# EAGLE schematic schematic (EAGLE 9.6.2)
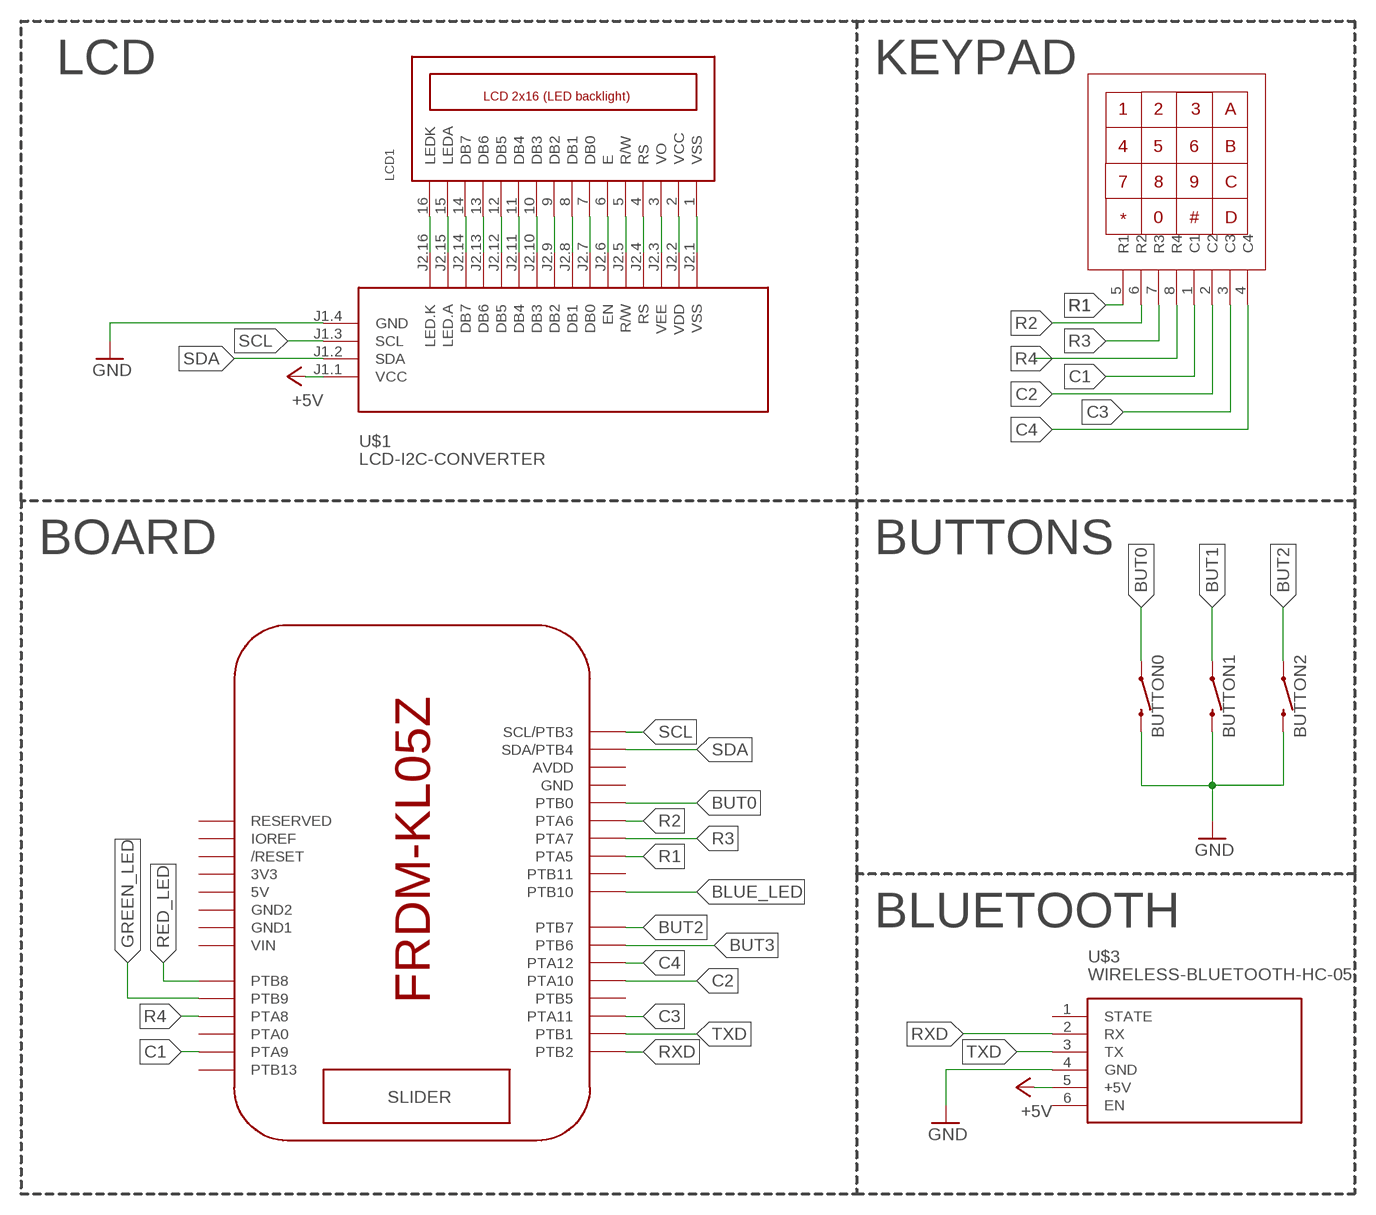
[diagram p0: schematic, sheet 1]

## Parts
BUTTON0  MOMENTARY-SWITCH-SPST-PTH-6.0MM  [TACTILE_SWITCH_PTH_6.0MM]
BUTTON1  MOMENTARY-SWITCH-SPST-PTH-6.0MM  [TACTILE_SWITCH_PTH_6.0MM]
BUTTON2  MOMENTARY-SWITCH-SPST-PTH-6.0MM  [TACTILE_SWITCH_PTH_6.0MM]
LCD1  LCD_2X16_SIL  [HY-1602F]
U1  ARDUINOR3-BPLACE  [ARDUINOR3-BPLACE]
U$1  LCD-I2C-CONVERTER  [LCD-I2C-CONVERTER]
U$2  KEYPAD4X4  [KEYPAD4X4]
U$3  WIRELESS-BLUETOOTH-HC-05  [WIRELESS-BLUETOOTH-HC-05]

## Nets
+5V: U$1.J1.1(VCC) U$3.5(+5V)
BLUE_LED: U1.GND2(PTB10)
BUT0: BUTTON0.1 U1.D8(PTB0)
BUT1: BUTTON1.1
BUT2: BUTTON2.1 U1.D13(PTB7)
BUT3: U1.D12(PTB6)
C1: U1.D4(PTA9) U$2.1(C1)
C2: U1.D5(PTA10) U$2.2(C2)
C3: U1.D6(PTA11) U$2.3(C3)
C4: U1.D7(PTA12) U$2.4(C4)
GND: BUTTON0.3 BUTTON1.3 BUTTON2.3 U$1.J1.4(GND)
GREEN_LED: U1.GND1(PTB9)
N$1: LCD1.16(LEDK) U$1.J2.16(LED.K)
N$2: LCD1.15(LEDA) U$1.J2.15(LED.A)
N$3: LCD1.14(DB7) U$1.J2.14(DB7)
N$4: LCD1.13(DB6) U$1.J2.13(DB6)
N$5: LCD1.12(DB5) U$1.J2.12(DB5)
N$6: LCD1.11(DB4) U$1.J2.11(DB4)
N$7: LCD1.10(DB3) U$1.J2.10(DB3)
N$8: LCD1.9(DB2) U$1.J2.9(DB2)
N$9: LCD1.8(DB1) U$1.J2.8(DB1)
N$10: LCD1.7(DB0) U$1.J2.7(DB0)
N$11: LCD1.5(R/W) U$1.J2.5(R/W)
N$12: LCD1.6(E) U$1.J2.6(EN)
N$13: LCD1.4(RS) U$1.J2.4(RS)
N$14: LCD1.3(VO) U$1.J2.3(VEE)
N$15: LCD1.2(VCC) U$1.J2.2(VDD)
N$16: LCD1.1(VSS) U$1.J2.1(VSS)
N$17: U$3.4(GND) ; supply symbol labelled GND
R1: U1.D0(PTA5) U$2.5(R1)
R2: U1.D1(PTA6) U$2.6(R2)
R3: U1.D2(PTA7) U$2.7(R3)
R4: U1.D3(PTA8) U$2.8(R4)
RED_LED: U1.GND(PTB8)
RXD: U1.D10(PTB2) U$3.2(RX)
SCL: U1.SCL(SCL/PTB3) U$1.J1.3(SCL)
SDA: U1.SDA(SDA/PTB4) U$1.J1.2(SDA)
TXD: U1.D9(PTB1) U$3.3(TX)
Unconnected: U1.3V(/RESET) U1.A1(AVDD) U1.A5(IOREF) U1.AREF(PTA0) U1.D11(PTB5) U1.IOREF(PTB11) U1.RESERVED(PTB13) U1.RESET(RESERVED) U$3.1(STATE) U$3.6(EN)

## Notes on the sheet
- LCD | KEYPAD
- BOARD | BUTTONS
- BLUETOOTH

## Power pins joined to a net without a drawn wire
3V3: U1.5V(3V3)
5V: U1.A0(5V)
GND: U1.A2(GND)
GND1: U1.A3(GND1)
GND2: U1.A4(GND2)
VIN: U1.VIN

## Library data of the parts
BUTTON0 BUTTON1 BUTTON2 = SparkFun-Switches:MOMENTARY-SWITCH-SPST: Momentary Switch (Pushbutton) - SPST Normally-open (NO) SPST momentary switches (buttons, pushbuttons). Variants PTH-12MM - 12mm square, through-hole Momentary Pushbutton Switch - 12mm Square <https://www.sparkfun.com/products/9190> (COM-09190) PTH-6.0MM, PTH-6.0MM-KIT - 6.0mm square, through-hole Mini Pushbutton Switch <https://www.sparkfun.com/products/97> (COM-00097) KIT package intended for soldering kit's - only one side of pads' copper is exposed. PTH-RIGHT-ANGLE-KIT - Right-angle, through-hole Right Angle Tactile Button <https://www.sparkfun.com/products/10791> - Used on SparkFun BigTime Watch Kit <https://www.sparkfun.com/products/11734> SMD-12MM - 12mm square, surface-mount Tactile Button - SMD (12mm) <https://www.sparkfun.com/products/12993> (COM-12993) Used on SparkFun PicoBoard <https://www.sparkfun.com/products/11888> SMD-4.5MM - 4.5mm Square Trackball Switch Used on SparkFun Blackberry Trackballer Breakout <https://www.sparkfun.com/products/13169> SMD-4.6MMX2.8MM - 4.60mm x 2.80mm, surface mount Used on SparkFun SAMD21 Mini Breakout <https://www.sparkfun.com/products/13664> SMD-5.2MM, SMD-5.2-REDUNDANT - 5.2mm square, surface-mount Mini Pushbutton Switch - SMD <https://www.sparkfun.com/products/8720> (COM-08720) Used on Arduino Pro Mini <https://www.sparkfun.com/products/11114> REDUNDANT package connects both switch circuits together SMD-6.0X3.5MM - 6.0 x 3.5mm, surface mount Momentary Reset Switch SMD <https://www.sparkfun.com/products/8229> (COM-08229) SMD-6.2MM-TALL - 6.2mm square, surface mount Tactile Button - SMD (6mm) <https://www.sparkfun.com/products/12992> Used on SparkFun Digital Sandbox <https://www.sparkfun.com/products/12651> SMD-RIGHT-ANGLE - Right-angle, surface mount Used on SparkFun Block for Intel® Edison - Arduino <https://www.sparkfun.com/products/13036>; PROD_ID: SWCH-08441; SF_SKU: COM-00097
LCD1 = lcd_2x16_led_backlight:LCD_2X16_SIL
U1 = kl05z:ARDUINOR3: This is a new object for the new Arduino R3 - with extra pins that you may want to use (such as IOref, and duplicated A4/A5
U$1 = diy-modules:LCD-I2C-CONVERTER: I2C Bus to 4-Bit Parallel LCD Interface with LED backlight driver
U$2 = keypad_4x4_raw:KEYPAD4X4
U$3 = diy-modules:WIRELESS-BLUETOOTH-HC-05: Bluetooth Transceiver Module based on HC-05 board Tutorial is available here: https://arduino-info.wikispaces.com/BlueTooth-HC05-HC06-Modules-How-To Click here to find device on ebay.com <http://www.ebay.com/sch/hc-05+module+rs232>